# EAGLE design miniCFO-roskilde (EAGLE 5.11)
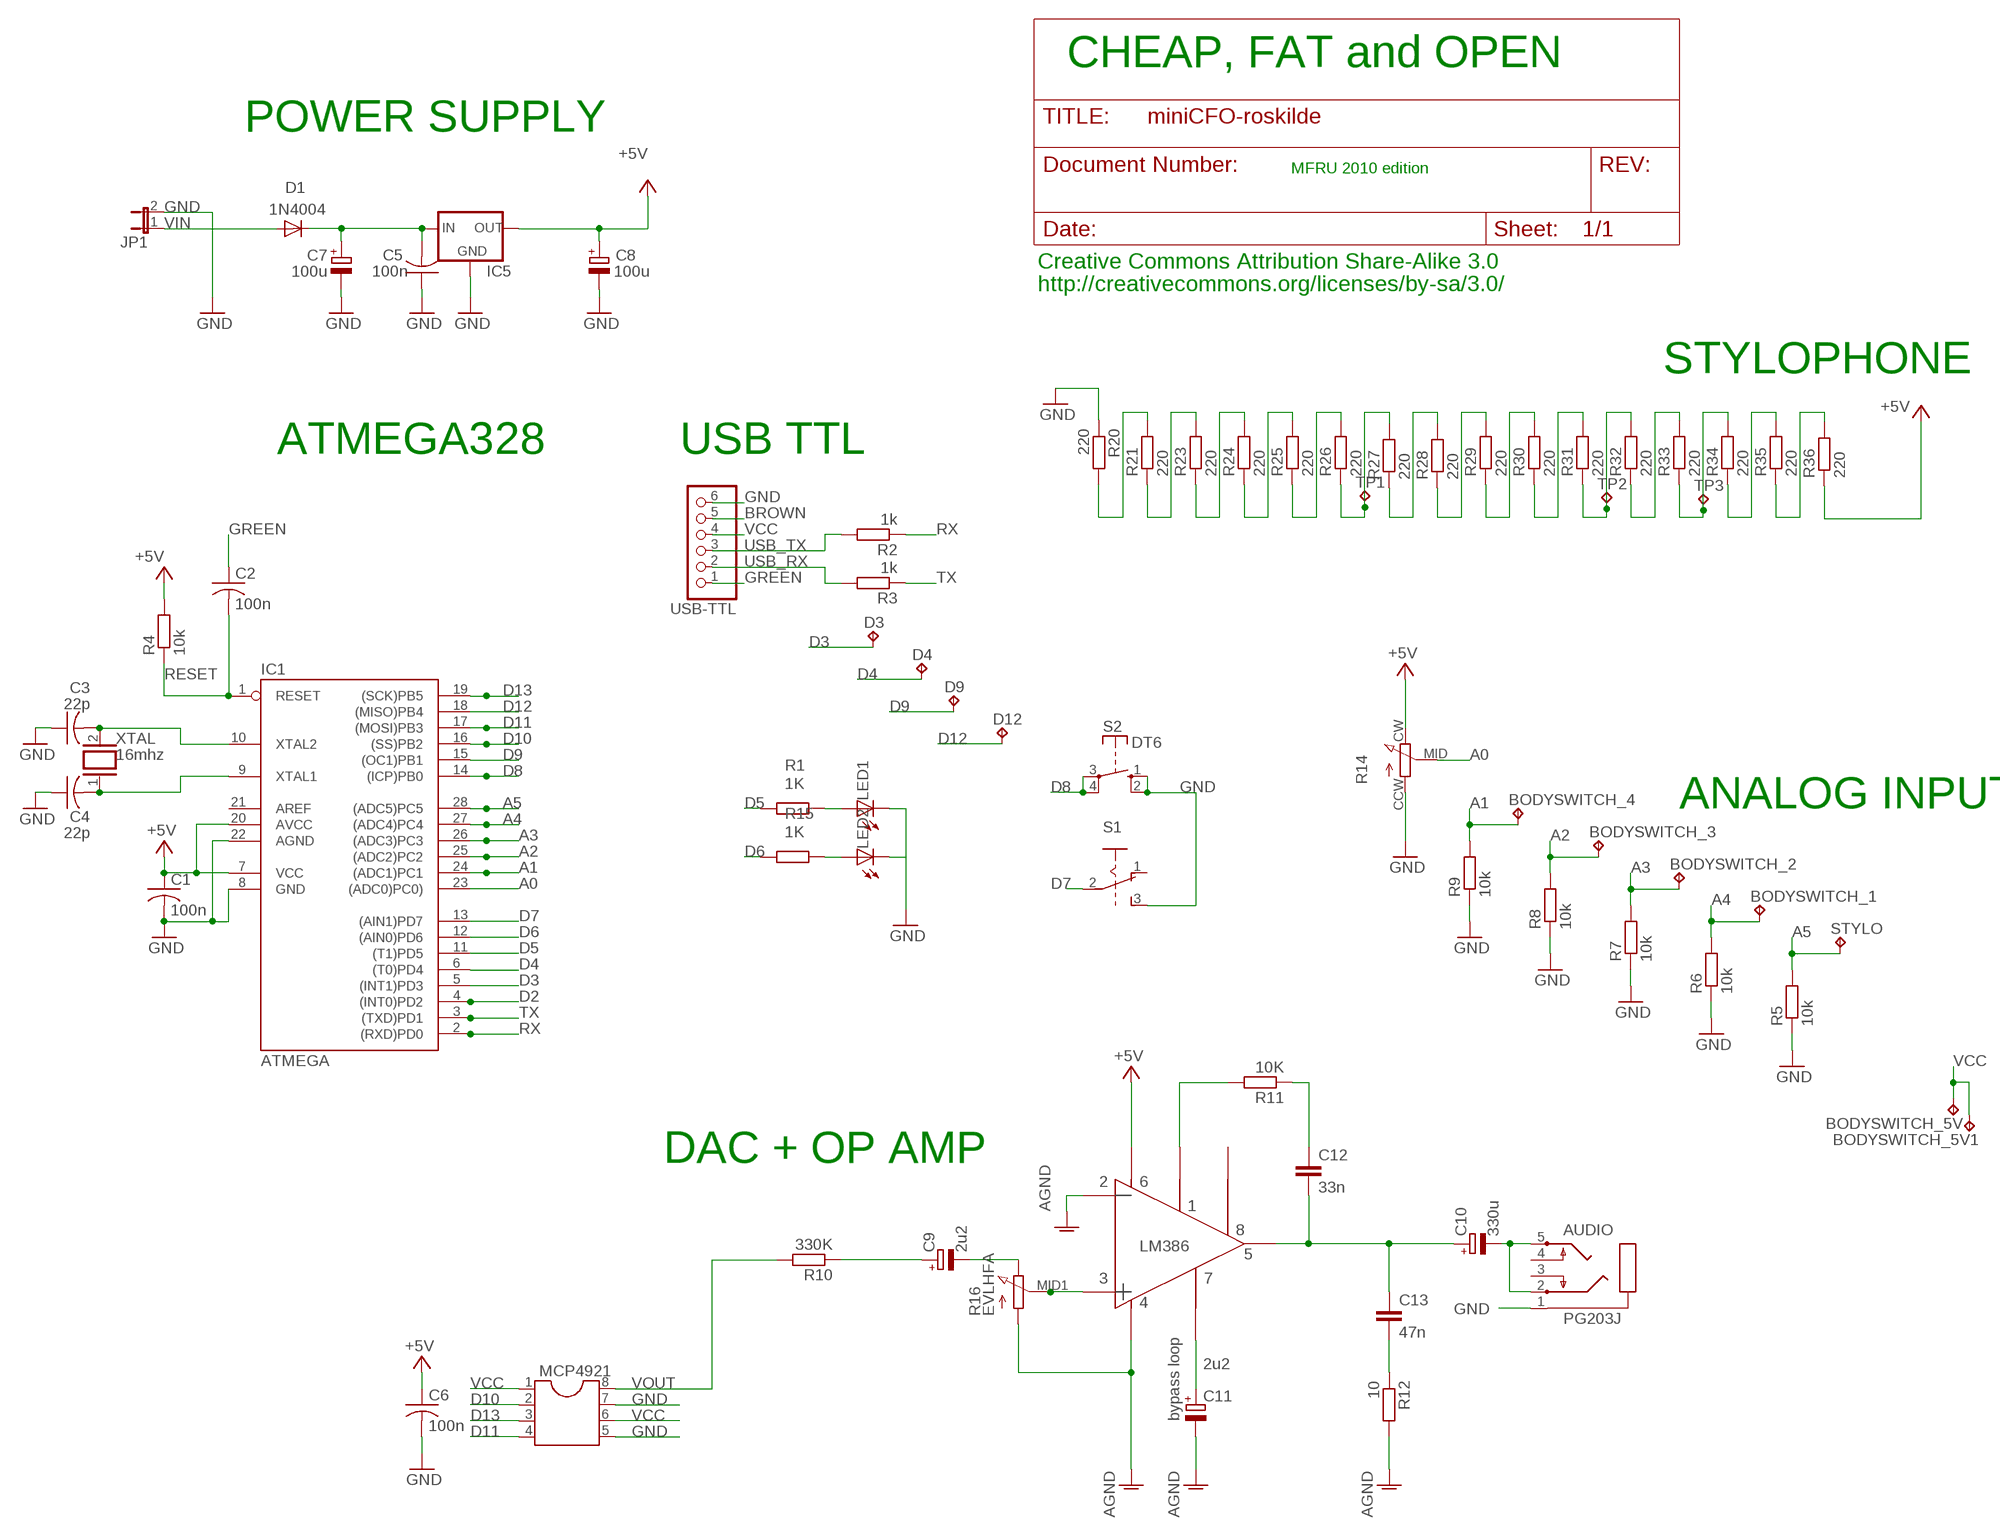
[diagram p0: schematic, sheet 1]

## Parts
AUDIO  PG203J  [PG203J]
BODYSWITCH_1  TPPAD1-13  [P1-13]
BODYSWITCH_2  TPPAD1-13  [P1-13]
BODYSWITCH_3  TPPAD1-13  [P1-13]
BODYSWITCH_4  TPPAD1-13  [P1-13]
BODYSWITCH_5V  TPPAD1-13  [P1-13]
BODYSWITCH_5V1  TPPAD1-13  [P1-13]
C1  100n  C-US050-035X075  [C050-035X075]
C2  100n  C-US050-035X075  [C050-035X075]
C3  22p  C-US050-024X044  [C050-024X044]
C4  22p  C-US050-024X044  [C050-024X044]
C5  100n  C-US050-035X075  [C050-035X075]
C6  100n  C-US050-035X075  [C050-035X075]
C7  100u  CPOL-EUE2-5  [E2-5]
C8  100u  CPOL-EUE2-5  [E2-5]
C9  2u2  CPOL-EUE2-5  [E2-5]
C10  330u  CPOL-EUE2.5-7  [E2,5-7]
C11  2u2  CPOL-EUE2-5  [E2-5]
C12  33n  C-EU050-024X044  [C050-024X044]
C13  47n  C-EU050-024X044  [C050-024X044]
D1  1N4004  [DO41-10]
D3  TPPAD1-13  [P1-13]
D4  TPPAD1-13  [P1-13]
D9  TPPAD1-13  [P1-13]
D12  TPPAD1-13  [P1-13]
IC1  ATMEGA  AT90S4433P  [DIL28-3]
IC5  78XXL  [78XXL]
JP1  JP1E  [JP1]
LED1  LED5MM  [LED5MM]
LED2  LED5MM  [LED5MM]
MCP4921  DIL8  [DIL08]
R1  1K  R-EU_0207/10  [0207/10]
R2  1k  R-EU_0207/10  [0207/10]
R3  1k  R-EU_0207/10  [0207/10]
R4  10k  R-EU_0207/10  [0207/10]
R5  10k  R-EU_0207/10  [0207/10]
R6  10k  R-EU_0207/10  [0207/10]
R7  10k  R-EU_0207/10  [0207/10]
R8  10k  R-EU_0207/10  [0207/10]
R9  10k  R-EU_0207/10  [0207/10]
R10  330K  R-EU_0207/10  [0207/10]
R11  10K  R-EU_0207/10  [0207/10]
R12  10  R-EU_0207/10  [0207/10]
R14  P120PK  [P120PK]
R15  1K  R-EU_0207/10  [0207/10]
R16  EVLHFA  [EVLHFA]
R20  220  R-EU_0207/10  [0207/10]
R21  220  R-EU_0207/10  [0207/10]
R23  220  R-EU_0207/10  [0207/10]
R24  220  R-EU_0207/10  [0207/10]
R25  220  R-EU_0207/10  [0207/10]
R26  220  R-EU_0207/10  [0207/10]
R27  220  R-EU_0207/10  [0207/10]
R28  220  R-EU_0207/10  [0207/10]
R29  220  R-EU_0207/10  [0207/10]
R30  220  R-EU_0207/10  [0207/10]
R31  220  R-EU_0207/10  [0207/10]
R32  220  R-EU_0207/10  [0207/10]
R33  220  R-EU_0207/10  [0207/10]
R34  220  R-EU_0207/10  [0207/10]
R35  220  R-EU_0207/10  [0207/10]
R36  220  R-EU_0207/10  [0207/10]
S1  EG1218  [GF-126-0159]
S2  DT6  [DT6]
STYLO  TPPAD1-13  [P1-13]
TP1  TPPAD1-13  [P1-13]
TP2  TPPAD1-13  [P1-13]
TP3  TPPAD1-13  [P1-13]
U$1  LM386  LM386OA  [LM386]
USB-TTL  PINHD-1X6  [1X06]
XTAL  16mhz  XTAL/S  [QS]

## Nets
A0: IC1.23((ADC0)PC0)) R14.MID
A1: BODYSWITCH_4.1(TP) IC1.24((ADC1)PC1) R9.2
A2: BODYSWITCH_3.1(TP) IC1.25((ADC2)PC2) R8.2
A3: BODYSWITCH_2.1(TP) IC1.26((ADC3)PC3) R7.2
A4: BODYSWITCH_1.1(TP) IC1.27((ADC4)PC4) R6.2
A5: IC1.28((ADC5)PC5) R5.2 STYLO.1(TP)
BROWN: USB-TTL.5
D2: IC1.4((INT0)PD2)
D3: D3.1(TP) IC1.5((INT1)PD3)
D4: D4.1(TP) IC1.6((T0)PD4)
D5: IC1.11((T1)PD5) R1.2
D6: IC1.12((AIN0)PD6) R15.2
D7: IC1.13((AIN1)PD7) S1.2
D8: IC1.14((ICP)PB0) S2.3(P) S2.4(P)
D9: D9.1(TP) IC1.15((OC1)PB1)
D10: IC1.16((SS)PB2) MCP4921.2
D11: IC1.17((MOSI)PB3) MCP4921.4
D12: D12.1(TP) IC1.18((MISO)PB4)
D13: IC1.19((SCK)PB5) MCP4921.3
GND [power]: AUDIO.1 C1.2 C3.1 C4.1 C5.1 C6.2 C7.- C8.- C11.- IC1.8(GND) IC1.22(AGND) IC5.GND JP1.2 LED1.K(C) LED2.K(C) MCP4921.5 MCP4921.7 R5.1 R6.1 R7.1 R8.1 R9.1 R12.2 R14.CCW R16.CCW R20.1 S1.3 S2.1(S) S2.2(S) U$1.2 U$1.4 USB-TTL.6 ; supply symbol labelled AGND
GREEN: C2.1 USB-TTL.1
LEFT: C9.- R16.CW
N$1: C9.+ R10.1
N$2: R11.2 U$1.1
N$3: LED1.A R1.1
N$4: R20.2 R21.2
N$6: C4.2 IC1.9(XTAL1) XTAL.1
N$7: C3.2 IC1.10(XTAL2) XTAL.2
N$9: C12.1 R11.1
N$10: C11.+ U$1.7
N$12: LED2.A R15.1
N$50: R21.1 R23.2
N$51: R23.1 R24.2
N$53: R24.1 R25.2
N$55: R25.1 R26.2
N$56: R26.1 R27.2 TP1.1(TP)
N$57: R27.1 R28.2
N$58: R28.1 R29.2
N$59: R29.1 R30.2
N$60: R30.1 R31.2
N$61: R31.1 R32.2 TP2.1(TP)
N$62: R32.1 R33.2
N$63: R33.1 R34.2 TP3.1(TP)
N$64: R34.1 R35.2
N$65: R35.1 R36.2
N$78: C13.2 R12.1
N$82: R16.MID1 R16.MID2 U$1.3
N$84: AUDIO.2 AUDIO.5 C10.-
N$99: C10.+ C12.2 C13.1 U$1.5
N$999 [power]: C5.2 C7.+ D1.C IC5.IN
RESET: C2.2 IC1.1(RESET) R4.1
RX: IC1.2((RXD)PD0) R2.1
TX: IC1.3((TXD)PD1) R3.1
USB_RX: R3.2 USB-TTL.2
USB_TX: R2.2 USB-TTL.3
VCC [power]: BODYSWITCH_5V1.1(TP) BODYSWITCH_5V.1(TP) C1.1 C6.1 C8.+ IC1.7(VCC) IC1.20(AVCC) IC5.OUT MCP4921.1 MCP4921.6 R4.2 R14.CW R36.1 U$1.6 USB-TTL.4 ; supply symbol labelled +5V
VIN [power]: D1.A JP1.1
VOUT: MCP4921.8 R10.2
Unconnected: AUDIO.3 AUDIO.4 S1.1 U$1.8

## Notes on the sheet
- CHEAP, FAT and OPEN
- POWER SUPPLY
- MFRU 2010 edition
- Creative Commons Attribution Share-Alike 3.0
- http://creativecommons.org/licenses/by-sa/3.0/
- STYLOPHONE
- ATMEGA328 | USB TTL
- ANALOG INPUT
- DAC + OP AMP
- bypass loop

## Power pins joined to a net without a drawn wire
AREF: IC1.21(AREF)

## Library data of the parts
AUDIO = con-hirschmann:PG203J: MIC/HEADPHONE JACK KS-S stereo microphone/headphone jack PG203JN (Schukat)
BODYSWITCH_1-BODYSWITCH_4 BODYSWITCH_5V BODYSWITCH_5V1 D3 D4 D9 D12 STYLO TP1-TP3 = testpad:TP: Test pad
C1-C6 = rcl:C-US: CAPACITOR, American symbol
C7-C11 = rcl:CPOL-EU: POLARIZED CAPACITOR, European symbol
C12 C13 = rcl:C-EU: CAPACITOR, European symbol
D1 = diode:1N4004: DIODE general purpose rectifier, 1 A
IC1 = atmel:AT90S4433: MICROCONTROLLER 4 Kbytes FLASH 128 bytes SRAM 256 bytes EEPROM UART 6-channel 10 bit ADC
IC5 = v-reg:78XXL: VOLTAGE REGULATOR
JP1 = jumper:JP1E: JUMPER
LED1 LED2 = led:LED: LED OSRAM: - CHIPLED LG R971, LG N971, LY N971, LG Q971, LY Q971, LO R971, LY R971 LH N974, LH R974 LS Q976, LO Q976, LY Q976 LO Q996 - Hyper CHIPLED LW Q18S LB Q993, LB Q99A, LB R99A - SideLED LS A670, LO A670, LY A670, LG A670, LP A670 LB A673, LV A673, LT A673, LW A673 LH A674 LY A675 LS A676, LA A676, LO A676, LY A676, LW A676 LS A679, LY A679, LG A679 - Hyper Micro SIDELED® LS Y876, LA Y876, LO Y876, LY Y876 LT Y87S - SmartLED LW L88C, LW L88S LB L89C, LB L89S, LG L890 LS L89K, LO L89K, LY L89K LS L896, LA L896, LO L896, LY L896 - TOPLED LS T670, LO T670, LY T670, LG T670, LP T670 LSG T670, LSP T670, LSY T670, LOP T670, LYG T670 LG T671, LOG T671, LSG T671 LB T673, LV T673, LT T673, LW T673 LH T674 LS T676, LA T676, LO T676, LY T676, LB T676, LH T676, LSB T676, LW T676 LB T67C, LV T67C, LT T67C, LS T67K, LO T67K, LY T67K, LW E67C LS E67B, LA E67B, LO E67B, LY E67B, LB E67C, LV E67C, LT E67C LW T67C LS T679, LY T679, LG T679 LS T770, LO T770, LY T770, LG T770, LP T770 LB T773, LV T773, LT T773, LW T773 LH T774 LS E675, LA E675, LY E675, LS T675 LS T776, LA T776, LO T776, LY T776, LB T776 LHGB T686 LT T68C, LB T68C - Hyper Mini TOPLED® LB M676 - Mini TOPLED Santana® LG M470 LS M47K, LO M47K, LY M47K Source: http://www.osram.convergy.de LUXEON: - LUMILED® LXK2-PW12-R00, LXK2-PW12-S00, LXK2-PW14-U00, LXK2-PW14-V00 LXK2-PM12-R00, LXK2-PM12-S00, LXK2-PM14-U00 LXK2-PE12-Q00, LXK2-PE12-R00, LXK2-PE12-S00, LXK2-PE14-T00, LXK2-PE14-U00 LXK2-PB12-K00, LXK2-PB12-L00, LXK2-PB12-M00, LXK2-PB14-N00, LXK2-PB14-P00, LXK2-PB14-Q00 LXK2-PR12-L00, LXK2-PR12-M00, LXK2-PR14-Q00, LXK2-PR14-R00 LXK2-PD12-Q00, LXK2-PD12-R00, LXK2-PD12-S00 LXK2-PH12-R00, LXK2-PH12-S00 LXK2-PL12-P00, LXK2-PL12-Q00, LXK2-PL12-R00 Source: www.luxeon.com KINGBRIGHT: KA-3528ASYC Source: www.kingbright.com
MCP4921 = ic-package:DIL8: Dual In Line / Socket
R1-R12 R15 R20 R21 R23-R36 = rcl:R-EU_: RESISTOR, European symbol
R14 = videomusik:P120PK
R16 = videomusik:EVLHFA
S1 = videomusik:EG1218
S2 = switch-misc:DT: ITT SWITCH
U$1 = blushingboy_experimental:LM386
USB-TTL = pinhead:PINHD-1X6: PIN HEADER
XTAL = special:XTAL/S: CRYSTAL

## Net classes
1 power: width 0.61 mm

## Board
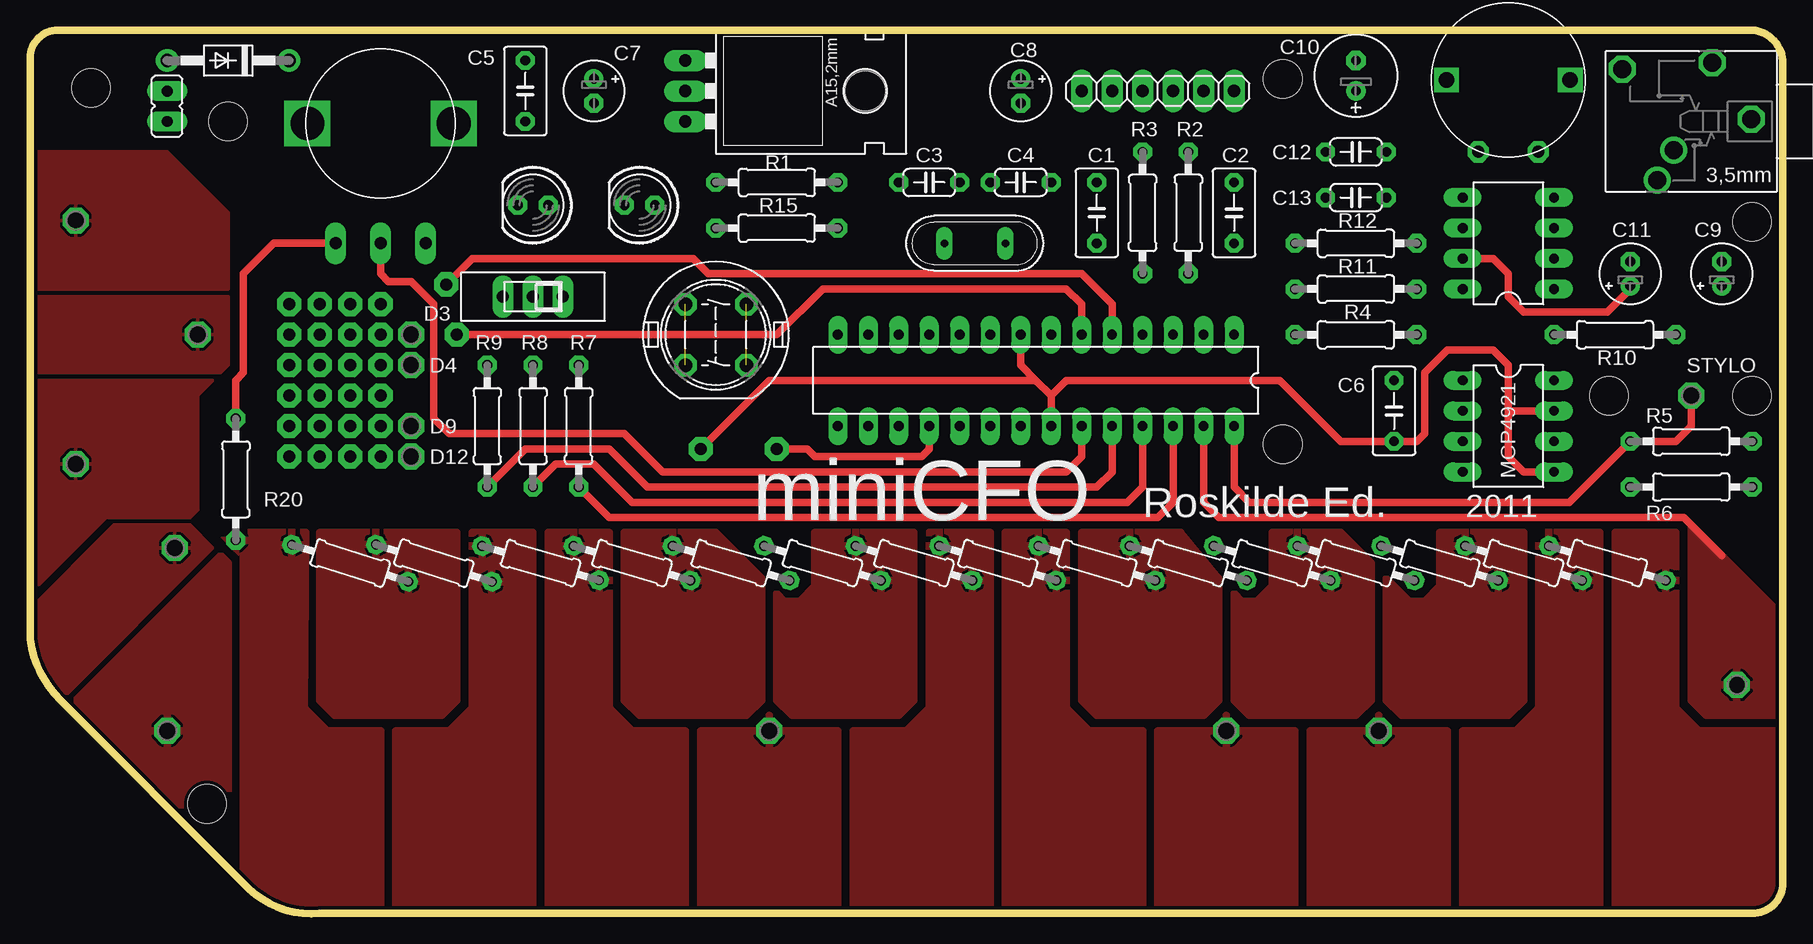
[diagram p1: board, top side]
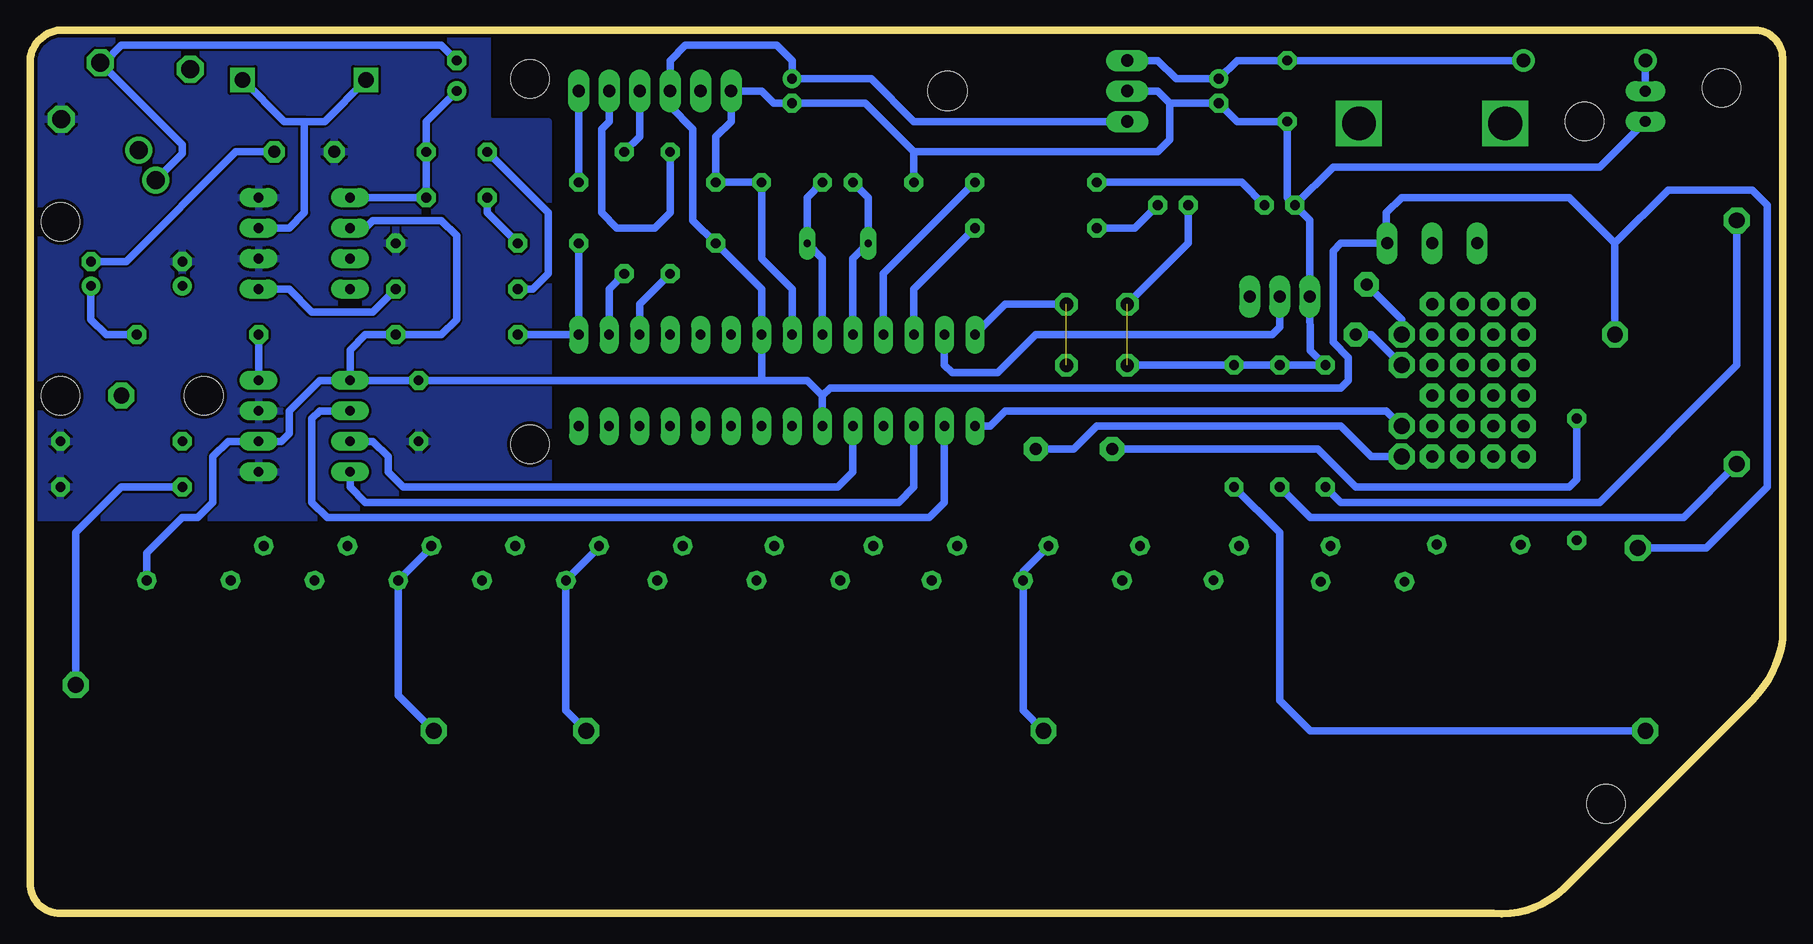
[diagram p2: board, bottom side, seen from below]

Size 146.06 x 73.69 mm. Coordinates in mm from the lower left corner, seen from the top.
Outline: 146.06,71.15 arc82 143.52,73.69 2.55,73.69 arc98 0.01,71.15 0.01,22.89 arc37 2.55,17.81 17.79,2.57 arc53 24.14,0.03 143.52,0.03 arc90 146.06,2.57 146.06,71.15
Copper layers (1*16): Top 0.035mm / dielectric 1.5mm / Bottom 0.035mm
Design rules "default *": minimum track width 10mil, minimum drill 0.8mm, track to track 8mil, track to pad 8mil, pad to pad 8mil, via to via 8mil, smd to smd 8mil, copper to edge 0.3mm, drill to drill 0.3mm, minimum pad ring 15mil, minimum via ring 20mil, stop-mask expansion 4mil, vias tented up to drill 0mil, thermal gap 10mil
Holes 3.2 mm at 143.52,43.21 16.52,66.07 104.4,69.62 131.58,43.21 143.52,57.68 104.4,39.14 14.74,9.17 5.09,68.86

### Footprints (pad centres in the part's own frame; a part is rotated, then mirrored left to right if it is on the bottom)
PG203J = drill 1.499 octagon: 1 -5.004,-0.203; 4 5.74,-4.369; 5 -1.753,-4.902 | drill 1.499 round: 2 2.845,4.902; 3 1.448,2.388
P1-13 = drill 1.321 pad 2.159 octagon: 1 0,0
C050-035X075 = drill 0.813 octagon: 1 -2.54,0; 2 2.54,0
C050-024X044 = drill 0.813 octagon: 1 -2.54,0; 2 2.54,0
E2-5 = drill 0.813 pad 1.27 round: + -1.016,0 | drill 0.813 pad 1.27 octagon: - 1.016,0
E2,5-7 = drill 0.813 pad 1.6 round: + -1.27,0 | drill 0.813 pad 1.6 octagon: - 1.27,0
DO41-10 = drill 1.118 round: A 5.08,0; C -5.08,0
DIL28-3 = drill 0.813 long: 1 -16.51,-3.81; 2 -13.97,-3.81; 3 -11.43,-3.81; 4 -8.89,-3.81; 5 -6.35,-3.81; 6 -3.81,-3.81; 7 -1.27,-3.81; 8 1.27,-3.81; 9 3.81,-3.81; 10 6.35,-3.81; 11 8.89,-3.81; 12 11.43,-3.81; 13 13.97,-3.81; 14 16.51,-3.81; 15 16.51,3.81; 16 13.97,3.81; 17 11.43,3.81; 18 8.89,3.81; 19 6.35,3.81; 20 3.81,3.81; 21 1.27,3.81; 22 -1.27,3.81; 23 -3.81,3.81; 24 -6.35,3.81; 25 -8.89,3.81; 26 -11.43,3.81; 27 -13.97,3.81; 28 -16.51,3.81
78XXL = drill 1.016 long: GND 0,-3.81; IN -2.54,-3.81; OUT 2.54,-3.81 | hole 3.302: 0,11.176
JP1 = drill 0.914 long: 1 0,-1.27; 2 0,1.27
LED5MM = drill 0.813 octagon: A -1.27,0; K 1.27,0
DIL08 = drill 0.813 long: 1 -3.81,-3.81; 2 -1.27,-3.81; 3 1.27,-3.81; 4 3.81,-3.81; 5 3.81,3.81; 6 1.27,3.81; 7 -1.27,3.81; 8 -3.81,3.81
0207/10 = drill 0.813 octagon: 1 -5.08,0; 2 5.08,0
P120PK = drill 1 long: CCW -3.75,0; CW 3.75,0; MID 0,0 | drill 2.8 square: LEFTLEG -6.1,10; RIGHTLEG 6.1,10
EVLHFA = drill 1 octagon: CCW -2.5,0; CW 2.5,0 | drill 1.3 square: MID1 -5.15,6; MID2 5.15,6
GF-126-0159 = drill 1 long: 1 -2.5,0; 2 0,0; 3 2.5,0
DT6 = drill 1.118 octagon: 1 -2.54,2.54; 2 2.54,2.54; 3 2.54,-2.54; 4 -2.54,-2.54
LM386 = drill 0.813 long: 1 2.54,-2.54; 2 5.08,-2.54; 3 7.62,-2.54; 4 10.16,-2.54; 5 10.16,5.08; 6 7.62,5.08; 7 5.08,5.08; 8 2.54,5.08
1X06 = drill 1.016 long: 1 -6.35,0; 2 -3.81,0; 3 -1.27,0; 4 1.27,0; 5 3.81,0; 6 6.35,0
QS = drill 0.61 long: 1 -2.54,0; 2 2.54,0

### Placement (x,y rotation side)
AUDIO  138.44,66.07 180 top
BODYSWITCH_1  142.25,19.08 0 top
BODYSWITCH_2  11.44,15.27 0 top
BODYSWITCH_3  3.82,37.49 0 top
BODYSWITCH_4  3.82,57.81 0 top
BODYSWITCH_5V  12.07,30.51 0 top
BODYSWITCH_5V1  13.98,48.29 0 top
C1  88.91,58.45 90 top
C2  100.34,58.45 270 top
C3  74.94,60.99 0 top
C4  82.56,60.99 180 top
C5  41.28,68.61 90 top
C6  113.67,41.94 270 top
C7  47,68.61 270 top
C8  82.56,68.61 270 top
C9  140.98,53.37 90 top
C10  110.5,69.88 90 top
C11  133.36,53.37 90 top
C12  110.5,63.53 0 top
C13  110.5,59.72 180 top
D1  16.52,71.15 180 top
D3  31.76,48.29 0 top
D4  31.76,45.75 0 top
D9  31.76,40.67 0 top
D12  31.76,38.13 0 top
IC1  83.83,44.48 180 top
IC5  58.43,68.61 270 top
JP1  11.44,67.34 180 top
LED1  41.92,59.08 180 top
LED2  50.81,59.08 180 top
MCP4921  123.2,40.67 270 top
R1  62.24,60.99 0 top
R2  96.53,58.45 90 top
R3  92.72,58.45 90 top
R4  110.5,48.29 0 top
R5  138.44,39.4 180 top
R6  138.44,35.59 180 top
R7  45.73,40.67 270 top
R8  41.92,40.67 270 top
R9  38.11,40.67 270 top
R10  132.09,48.29 180 top
R11  110.5,52.1 0 top
R12  110.5,55.91 0 top
R14  29.22,55.91 0 top
R15  62.24,57.18 0 top
R16  123.2,63.53 0 top
R20  17.15,36.22 270 top
R21  26.68,29.24 162.4 top
R23  33.66,29.24 162.2 top
R24  42.55,29.24 163.7 top
R25  50.17,29.24 163.5 top
R26  58.43,29.24 163.5 top
R27  66.05,29.24 163.5 top
R28  73.67,29.24 163.5 top
R29  80.65,29.24 163.5 top
R30  88.91,29.24 163.5 top
R31  96.53,29.24 163.5 top
R32  103.51,29.24 163.5 top
R33  110.5,29.24 163.5 top
R34  117.48,29.24 163.5 top
R35  124.47,29.24 163.5 top
R36  131.45,29.24 163.5 top
S1  41.92,51.46 180 top
S2  57.16,48.29 90 top
STYLO  138.44,43.21 0 top
TP1  61.6,15.27 0 top
TP2  99.7,15.27 0 top
TP3  112.4,15.27 0 top
U$1  124.47,49.56 90 top
USB-TTL  93.99,68.61 180 top
XTAL  78.75,55.91 180 top

### Tracks (layer width: path | path; a pad name or v marks a point on that pad's centre or on a via)
A0
  Top 0.61: IC1.23 87.64,38.13 86.37,36.86 52.71,36.86 49.54,40.03 34.93,40.03 33.66,41.3 33.66,50.83 31.76,52.73 29.85,52.73 29.22,53.37 R14.MID
A1
  Top 0.61: IC1.24 90.18,36.86 88.91,35.59 51.44,35.59 48.27,38.76 41.28,38.76 R9.2
  Bottom 0.61: BODYSWITCH_4.1 3.82,45.75 15.25,34.32 36.84,34.32 R9.2
  pour Top: 16.52,58.45 11.44,63.53 0.01,63.53 0.01,52.1 16.52,52.1
A2
  Top 0.61: R8.2 43.82,37.49 47,37.49 50.17,34.32 91.45,34.32 92.72,35.59 IC1.25
  Bottom 0.61: R8.2 39.38,33.05 8.26,33.05 BODYSWITCH_3.1
  pour Top: 13.34,33.05 6.36,33.05 0.01,26.7 0.01,44.48 15.25,44.48 13.98,43.21 13.98,33.68
A3
  Top 0.61: R7.2 48.27,33.05 93.99,33.05 95.26,34.32 IC1.26
  Bottom 0.61: BODYSWITCH_2.1 39.38,15.27 41.92,17.81 41.92,31.78 R7.2
  pour Top: 15.88,29.87 16.52,29.24 16.52,3.84 3.18,17.17
A4
  Top 0.61: 140.98,29.87 137.8,33.05 99.07,33.05 97.8,34.32 IC1.27
  Bottom 0.61: R6.2 138.44,35.59 142.25,31.78 BODYSWITCH_1.1
  pour Top: 146.06,16.54 139.71,16.54 138.44,17.81 138.44,32.41 146.06,24.79
A5
  Top 0.61: IC1.28 100.34,35.59 101.61,34.32 128.28,34.32 R5.2 137.17,39.4 138.44,40.67 STYLO.1
D3  (via drill 1)
  Top 0.61: IC1.5 90.18,50.83 87.64,53.37 56.52,53.37 55.25,54.64 36.84,54.64 v34.68,52.48
  Bottom 0.61: v34.68,52.48 31.76,49.56 D3.1
D4  (via drill 1)
  Top 0.61: IC1.6 87.64,50.83 86.37,52.1 66.05,52.1 62.24,48.29 v35.57,48.29
  Bottom 0.61: v35.57,48.29 34.3,48.29 D4.1
D5
  Bottom 0.61: IC1.11 74.94,53.37 R1.2
D6
  Bottom 0.61: IC1.12 72.4,52.1 R15.2
D7
  Bottom 0.61: S1.2 41.92,48.92 42.55,48.29 62.24,48.29 65.41,45.11 69.22,45.11 69.86,45.75 IC1.13
D8  (1 unrouted)
  Bottom 0.61: IC1.14 64.78,50.83 S2.3
D9
  Bottom 0.61: D9.1 33.03,41.94 64.78,41.94 66.05,40.67 IC1.15
D10
  Bottom 0.61: IC1.16 69.86,34.32 71.13,33.05 121.29,33.05 122.56,34.32 122.56,41.3 121.93,41.94 MCP4921.2
D11
  Bottom 0.61: IC1.17 72.4,35.59 73.67,34.32 118.12,34.32 119.39,35.59 MCP4921.4
D12  (via drill 1)
  Top 0.61: IC1.18 74.94,38.76 74.3,38.13 65.41,38.13 64.78,38.76 v62.24,38.76
  Bottom 0.61: v62.24,38.76 59.06,38.76 57.16,40.67 36.84,40.67 34.3,38.13 D12.1
D13
  Bottom 0.61: IC1.19 77.48,36.86 78.75,35.59 114.94,35.59 116.21,36.86 116.21,38.13 117.48,39.4 MCP4921.3
GND  (via drill 1)  (1 unrouted)
  Top 0.61: IC1.8 82.56,45.75 83.83,44.48 | 83.83,44.48 85.1,43.21 | 85.1,43.21 IC1.22 | 85.1,43.21 86.37,44.48 104.15,44.48 109.23,39.4 C6.2 115.58,39.4 116.21,40.03 116.21,45.11 118.12,47.02 121.93,47.02 123.2,45.75 123.2,41.94 | MCP4921.5 124.47,36.86 123.2,38.13 123.2,41.94 | 123.2,41.94 MCP4921.7 | v55.89,38.76 61.6,44.48 83.83,44.48 | R14.CCW 20.33,55.91 17.79,53.37 17.79,45.11 17.15,44.48 R20.1
  Bottom 0.61: R8.1 R9.1 39.38,46.98 S1.3 39.42,57.85 LED1.K | IC1.8 82.56,52.1 85.1,54.64 C4.1 C1.2 88.91,64.8 87.64,66.07 USB-TTL.6 85.1,68.61 84.08,67.59 C8.- 76.46,67.59 72.4,63.53 | R8.1 R7.1 | R8.1 S2.1 | 72.4,63.53 C3.1 | IC5.GND 52.08,68.61 51.06,67.59 | 51.06,67.59 C7.- 45.47,66.07 C5.1 41.28,59.72 LED1.K | S2.2 49.54,55.91 LED2.K | JP1.2 15.25,62.26 37.47,62.26 LED1.K | 72.4,63.53 52.08,63.53 51.06,64.54 51.06,67.59 | R20.1 17.15,36.22 17.79,35.59 35.57,35.59 38.74,38.76 v55.89,38.76
  pour Bottom: 146.06,73.69 107.96,73.69 107.96,66.07 102.88,66.07 102.88,33.05 146.06,33.05
GREEN
  Bottom 0.61: C2.1 USB-TTL.1
LEFT
  Bottom 0.61: R16.CW 128.91,63.53 138.05,54.38 C9.-
N$1
  Bottom 0.61: R10.1 139.71,48.29 140.98,49.56 C9.+
N$2
  Bottom 0.61: U$1.1 124.47,52.1 122.56,50.19 117.48,50.19 R11.2
N$3
  Bottom 0.61: R1.1 45.09,60.99 LED1.A
N$4
  pour Top: 15.88,31.78 22.99,31.78 22.87,17.17 24.77,15.27 29.22,15.27 29.22,0.03 21.6,0.03 17.79,2.57 17.79,29.87
N$5  (via drill 1)
  other vias: 29.22,38.13
N$6
  Bottom 0.61: C4.2 81.29,59.72 XTAL.1 80.02,54.64 IC1.9
N$7
  Bottom 0.61: C3.2 76.21,59.72 XTAL.2 77.48,54.64 IC1.10
N$8  (via drill 1)
  other vias: 29.22,40.67
N$9
  Bottom 0.61: C12.1 102.88,58.45 102.88,53.37 104.15,52.1 R11.1
N$10
  Top 0.61: U$1.7 121.93,54.64 123.2,53.37 123.2,51.46 124.47,50.19 131.45,50.19 133.36,52.1 C11.+
N$11  (via drill 1)
  other vias: 29.22,43.21
N$12
  Bottom 0.61: LED2.A 53.98,57.18 R15.1
N$13  (via drill 1)
  other vias: 29.22,45.75
N$14  (via drill 1)
  other vias: 29.22,48.29
N$15  (via drill 1)
  other vias: 29.22,50.83
N$16  (via drill 1)
  other vias: 26.68,50.83
N$17  (via drill 1)
  other vias: 24.14,50.83
N$18  (via drill 1)
  other vias: 21.6,50.83
N$19  (via drill 1)
  other vias: 21.6,48.29
N$20  (via drill 1)
  other vias: 24.14,48.29
N$21  (via drill 1)
  other vias: 26.68,48.29
N$22  (via drill 1)
  other vias: 26.68,45.75
N$23  (via drill 1)
  other vias: 24.14,45.75
N$24  (via drill 1)
  other vias: 21.6,45.75
N$25  (via drill 1)
  other vias: 21.6,43.21
N$26  (via drill 1)
  other vias: 21.6,40.67
N$27  (via drill 1)
  other vias: 24.14,43.21
N$28  (via drill 1)
  other vias: 26.68,43.21
N$29  (via drill 1)
  other vias: 26.68,40.67
N$30  (via drill 1)
  other vias: 24.14,40.67
N$31  (via drill 1)
  other vias: 26.68,38.13
N$32  (via drill 1)
  other vias: 24.14,38.13
N$33  (via drill 1)
  other vias: 21.6,38.13
N$50
  pour Top: 24.14,31.78 35.57,31.78 35.57,17.81 34.3,16.54 25.41,16.54 24.14,17.81
N$51
  pour Top: 41.92,0.03 30.49,0.03 30.49,15.27 34.93,15.27 36.84,17.17 36.84,31.78 41.92,31.78
N$53
  pour Top: 43.19,31.78 48.27,31.78 48.27,17.17 50.17,15.27 54.62,15.27 54.62,0.03 43.19,0.03
N$55
  pour Top: 49.54,17.81 49.54,31.78 57.16,31.78 60.97,27.97 60.97,17.81 59.7,16.54 50.81,16.54
N$56
  Bottom 0.61: R27.2 63.3,28.56 R26.1 63.3,16.96 TP1.1
  pour Top: 55.89,15.27 60.33,15.27 61.6,16.54 62.87,15.27 67.32,15.27 67.32,0.03 55.89,0.03
N$57
  pour Top: 62.24,26.7 62.87,26.06 64.14,26.06 65.41,27.33 65.41,31.78 73.67,31.78 73.67,17.81 72.4,16.54 63.51,16.54 62.24,17.81
N$58
  pour Top: 74.94,31.78 80.02,31.78 80.02,0.03 68.59,0.03 68.59,15.27 73.03,15.27 74.94,17.17
N$59
  pour Top: 81.29,31.78 86.37,31.78 86.37,17.17 88.27,15.27 92.72,15.27 92.72,0.03 81.29,0.03
N$60
  pour Top: 87.64,31.78 95.89,31.78 99.07,27.97 99.07,17.81 97.8,16.54 88.91,16.54 87.64,17.81
N$61
  Bottom 0.61: R32.2 98.64,30.55 R31.1 101.4,16.96 TP2.1
  pour Top: 99.7,16.54 100.97,15.27 105.42,15.27 105.42,0.03 93.99,0.03 93.99,15.27 98.43,15.27
N$62
  pour Top: 103.51,31.78 109.23,31.78 111.77,29.24 111.77,17.81 110.5,16.54 101.61,16.54 100.34,17.81 100.34,26.7 100.97,26.06 102.24,26.06 103.51,27.33
N$63
  Bottom 0.61: R34.2 112.61,30.55 R33.1 115.37,18.23 TP3.1
  pour Top: 112.4,16.54 113.67,15.27 118.12,15.27 118.12,0.03 106.69,0.03 106.69,15.27 111.13,15.27
N$64
  pour Top: 113.04,27.97 114.94,26.06 116.21,26.06 117.48,27.33 117.48,31.78 124.47,31.78 124.47,17.81 123.2,16.54 114.31,16.54 113.04,17.81
N$65
  pour Top: 125.74,31.78 130.82,31.78 130.82,0.03 119.39,0.03 119.39,15.27 123.83,15.27 125.74,17.17
N$78
  Bottom 0.61: C13.2 107.96,58.45 R12.1
N$82
  Bottom 0.61: U$1.3 124.47,57.18 123.2,58.45 123.2,66.07 | R16.MID1 121.51,66.07 123.2,66.07 | R16.MID2 124.89,66.07 123.2,66.07
N$84
  Bottom 0.61: C10.- 111.77,72.42 138.44,72.42 139.88,70.97 AUDIO.5 133.36,64.14 133.36,63.4 AUDIO.2
N$99
  Bottom 0.61: U$1.5 C13.1 C12.2 113.04,66.07 C10.+
N$999
  Bottom 0.61: IC5.IN 52.08,71.15 50.55,69.62 C7.+ 45.47,71.15 C5.2 D1.C
RESET
  Bottom 0.61: C2.2 IC1.1 R4.1
RX
  Bottom 0.61: IC1.2 97.8,52.1 R2.1
TX
  Bottom 0.61: IC1.3 95.26,50.83 R3.1
USB_RX
  Bottom 0.61: USB-TTL.2 97.8,66.07 98.43,65.43 98.43,58.45 97.16,57.18 93.99,57.18 92.72,58.45 R3.2
USB_TX
  Bottom 0.61: R2.2 95.26,64.8 USB-TTL.3
VCC
  Bottom 0.61: R36.1 136.32,30.08 133.36,33.05 132.09,33.05 130.82,34.32 130.82,38.13 129.55,39.4 MCP4921.6 125.1,39.4 124.47,40.03 124.47,41.94 121.93,44.48 MCP4921.1 | MCP4921.1 C6.1 85.1,44.48 | MCP4921.1 119.39,47.02 118.12,48.29 R4.2 111.77,48.29 110.5,49.56 110.5,56.54 111.77,57.81 117.48,57.81 118.12,57.18 U$1.6 | 80.02,43.21 IC1.20 | 80.02,43.21 81.29,44.48 85.1,44.48 | 85.1,44.48 IC1.7 85.1,52.1 C1.1 90.81,57.81 90.81,65.43 92.72,67.34 USB-TTL.4 92.72,71.15 91.45,72.42 83.83,72.42 82.56,71.15 C8.+ 75.95,69.62 72.4,66.07 IC5.OUT | 80.02,43.21 79.38,43.84 36.84,43.84 36.2,44.48 36.2,46.38 37.47,47.65 37.47,55.27 36.84,55.91 R14.CW 33.03,55.97 33.03,58.45 31.76,59.72 17.79,59.72 13.98,55.91 | 13.98,55.91 BODYSWITCH_5V1.1 | BODYSWITCH_5V.1 6.36,30.51 1.28,35.59 1.28,59.08 2.55,60.35 9.53,60.35 13.98,55.91
  pour Top: 6.99,32.41 13.34,32.41 15.25,30.51 2.55,17.81 0.01,22.25 0.01,25.43
  pour Top (isolate 0.305): 0.01,45.11 15.88,45.11 16.52,45.75 16.52,51.46 0.01,51.46
  pour Top: 132.09,31.78 137.17,31.78 137.17,17.17 139.07,15.27 146.06,15.27 146.06,0.03 132.09,0.03
VIN
  Bottom 0.61: D1.A JP1.1
VOUT
  Bottom 0.61: MCP4921.8 R10.2

### Text on the board
tValues: GND | +5V | TX | RX
_tsilk: miniCFO | Roskilde Ed. | 2011